# EAGLE design 2LD-20-mk-1.1.1 (EAGLE 7.5.0)
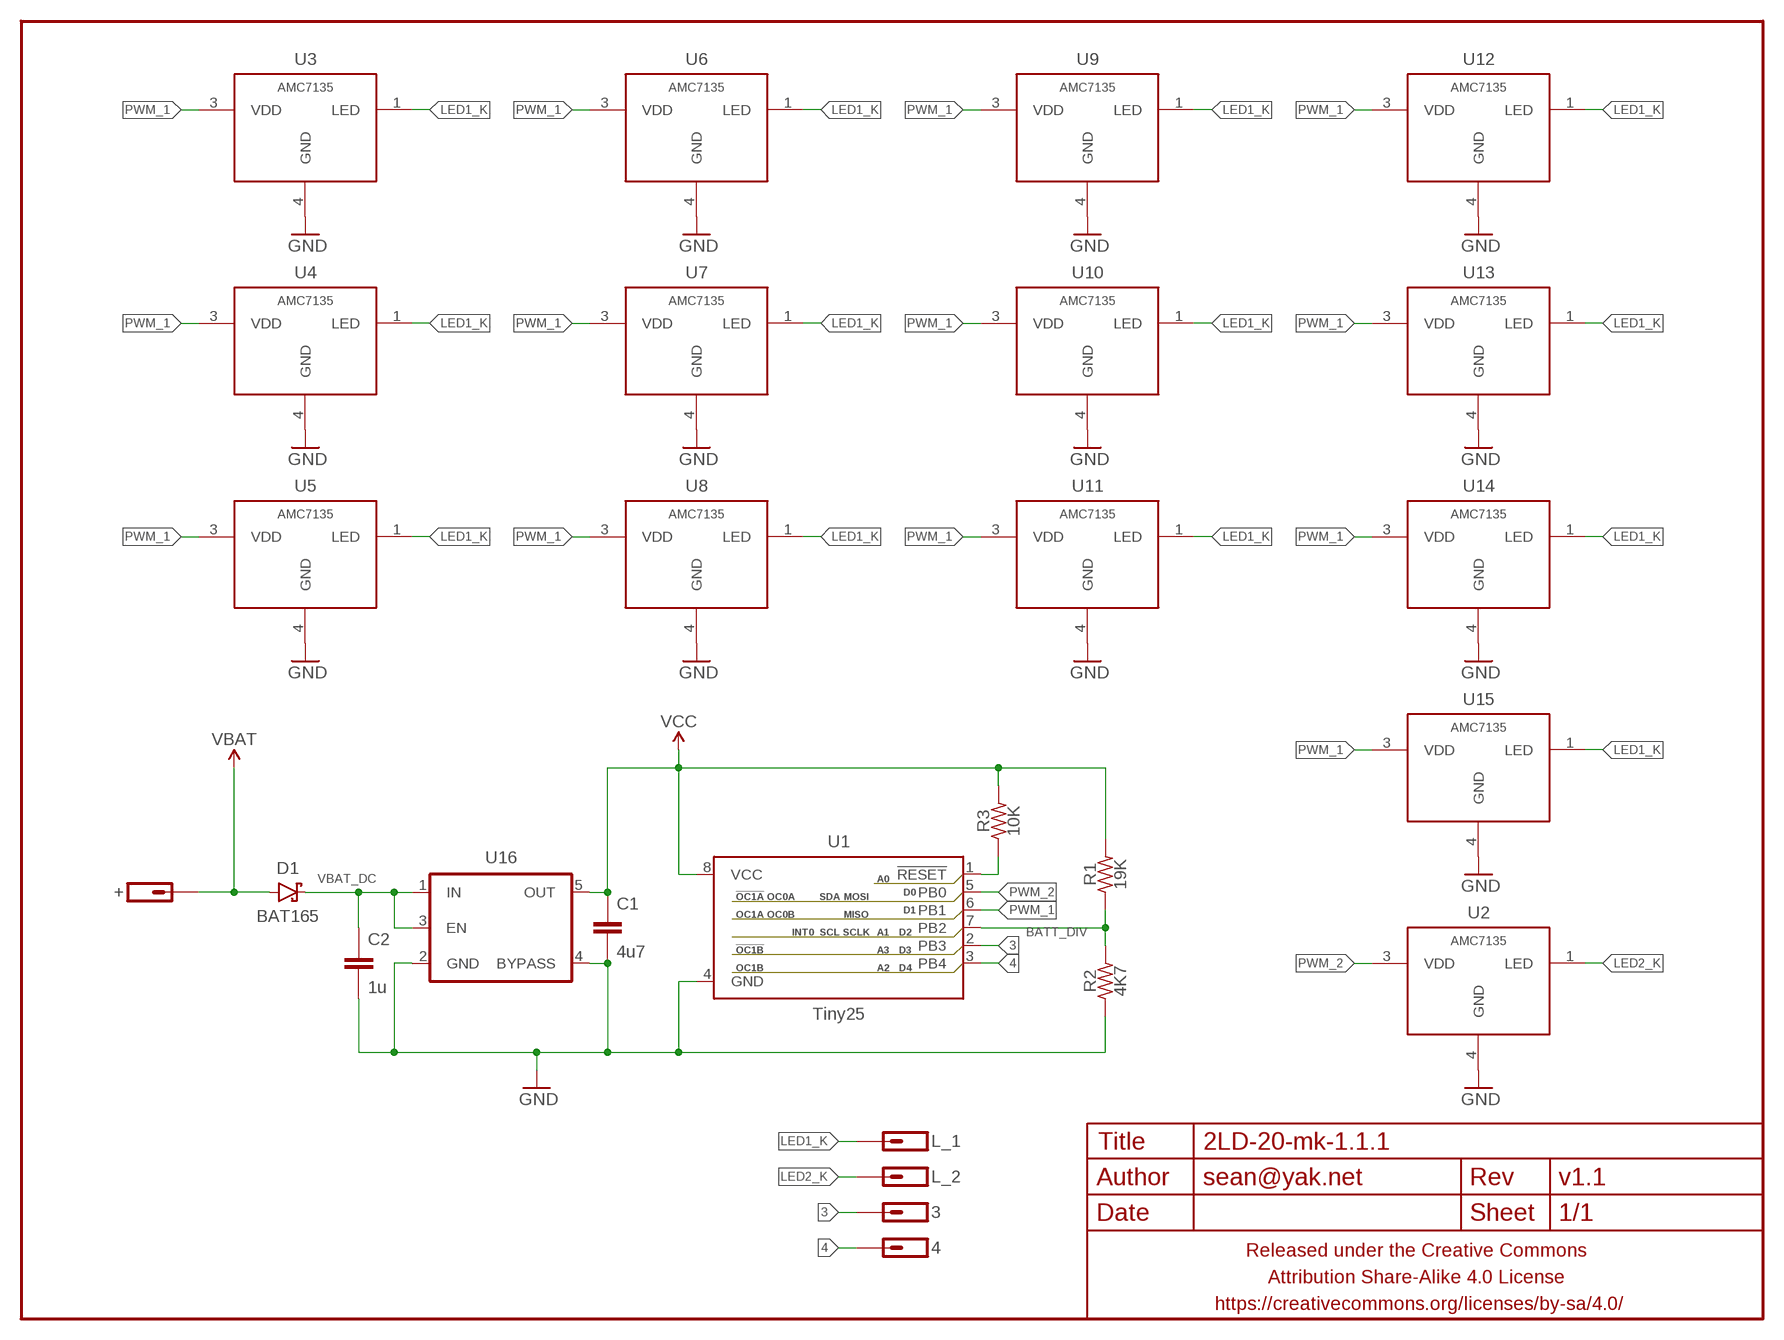
[diagram p0: schematic, sheet 1]

## Parts
3  M01SMD-0.8MM-DIA-NS  [1X01-SMD-0.8MM-DIA-NS]
4  M01SMD-0.8MM-DIA-NS  [1X01-SMD-0.8MM-DIA-NS]
+  M01PTH-1MM-CIR-NS  [1X01-1MM-CIR-NS]
C1  4u7  CAPACITOR-CERAMICC0603-TIGHTER  [C0603-TIGHTER]
C2  1u  CAPACITOR-CERAMICC0402  [C0402]
D1  BAT165  DIODE-SCHOTTKYSOD323  [SOD323-SCHOTTKY]
FRAME1  FRAME-LETTERNO_PACKAGE  [DUMMY]
L_1  M011X01-0.9MM-CIR  [1X01-0.9MM-CIR]
L_2  M01PTH-0.8MM-CIR  [1X01-0.8MM-CIR]
R1  19K  RESISTORR0402  [R0402]
R2  4K7  RESISTORR0402  [R0402]
R3  10K  RESISTORR0402  [R0402]
U1  Tiny25  ATTINY13SOIC-NARROWPADS  [SO08-NARROWER]
U2  AMC7135  AMC7135SOT-89-NOTHERM-ROUNDED-LESS  [SOT89-NOTHERM-ROUNDED-LESS]
U3  AMC7135  AMC7135SOT-89-NOTHERM-ROUNDED-LESS  [SOT89-NOTHERM-ROUNDED-LESS]
U4  AMC7135  AMC7135SOT-89-NOTHERM-ROUNDED-LESS  [SOT89-NOTHERM-ROUNDED-LESS]
U5  AMC7135  AMC7135SOT-89-NOTHERM-ROUNDED-LESS  [SOT89-NOTHERM-ROUNDED-LESS]
U6  AMC7135  AMC7135SOT-89-NOTHERM-ROUNDED-LESS  [SOT89-NOTHERM-ROUNDED-LESS]
U7  AMC7135  AMC7135SOT-89-NOTHERM-ROUNDED-LESS  [SOT89-NOTHERM-ROUNDED-LESS]
U8  AMC7135  AMC7135SOT-89-NOTHERM-ROUNDED-LESS  [SOT89-NOTHERM-ROUNDED-LESS]
U9  AMC7135  AMC7135SOT-89-NOTHERM-ROUNDED-LESS  [SOT89-NOTHERM-ROUNDED-LESS]
U10  AMC7135  AMC7135SOT-89-NOTHERM-ROUNDED-LESS  [SOT89-NOTHERM-ROUNDED-LESS]
U11  AMC7135  AMC7135SOT-89-NOTHERM-ROUNDED-LESS  [SOT89-NOTHERM-ROUNDED-LESS]
U12  AMC7135  AMC7135SOT-89-NOTHERM-ROUNDED-LESS  [SOT89-NOTHERM-ROUNDED-LESS]
U13  AMC7135  AMC7135SOT-89-NOTHERM-ROUNDED-LESS  [SOT89-NOTHERM-ROUNDED-LESS]
U14  AMC7135  AMC7135SOT-89-NOTHERM-ROUNDED-LESS  [SOT89-NOTHERM-ROUNDED-LESS]
U15  AMC7135  AMC7135SOT-89-NOTHERM-ROUNDED-LESS  [SOT89-NOTHERM-ROUNDED-LESS]
U16  V_REG_SOT-23-5AP2112  [SOT23-5]

## Nets
3: 3.P$1 U1.2(PB3)
4: 4.P$1 U1.3(PB4)
BATT_DIV: R1.1 R2.2 U1.7(PB2)
GND: C1.2 C2.2 R2.1 U1.4(GND) U2.4(GND) U3.4(GND) U4.4(GND) U5.4(GND) U6.4(GND) U7.4(GND) U8.4(GND) U9.4(GND) U10.4(GND) U11.4(GND) U12.4(GND) U13.4(GND) U14.4(GND) U15.4(GND) U16.2(GND) U16.4(BYPASS)
LED1_K: L_1.P$1 U3.1(LED) U4.1(LED) U5.1(LED) U6.1(LED) U7.1(LED) U8.1(LED) U9.1(LED) U10.1(LED) U11.1(LED) U12.1(LED) U13.1(LED) U14.1(LED) U15.1(LED)
LED2_K: L_2.1 U2.1(LED)
N$1: R3.1 U1.1(!RESET)
PWM_1: U1.6(PB1) U3.3(VDD) U4.3(VDD) U5.3(VDD) U6.3(VDD) U7.3(VDD) U8.3(VDD) U9.3(VDD) U10.3(VDD) U11.3(VDD) U12.3(VDD) U13.3(VDD) U14.3(VDD) U15.3(VDD)
PWM_2: U1.5(PB0) U2.3(VDD)
VBAT: +.1 D1.A
VBAT_DC: C2.1 D1.C U16.1(IN) U16.3(EN)
VCC: C1.1 R1.2 R3.2 U1.8(VCC) U16.5(OUT)

## Library data of the parts
3 4 + L_1 L_2 = a_parts:M01: Header 1 Standard 1-pin 0.1" header. Use with straight break away headers (SKU : PRT-00116), right angle break away headers (PRT-00553), swiss pins (PRT-00743), machine pins (PRT-00117), and female headers (PRT-00115).
C1 C2 = a_parts:CAPACITOR-CERAMIC: CAPACITOR, European symbol
D1 = a_parts:DIODE-SCHOTTKY: Schottky diodes in SFE's production catalog BAT20J 1A 23V 0.62Vf RB751 120mA 40V 0.37Vf PMEG4005EJ 0.5A 40V 0.42Vf MBRA140 1A 40V 0.5Vf B340A 3A 40V SMA
FRAME1 = a_parts:FRAME-LETTER: Schematic Frame Standard 8.5x11 US Letter frame; DESIGNER: sean@yak.net; VERSION: v1.1
R1-R3 = a_parts:RESISTOR: RESISTOR, American symbol
U1 = a_parts:ATTINY13: Atmel 8-pin 1kB flash uC
U2-U15 = a_parts:AMC7135
U16 = a_parts:V_REG_SOT-23-5

## Board
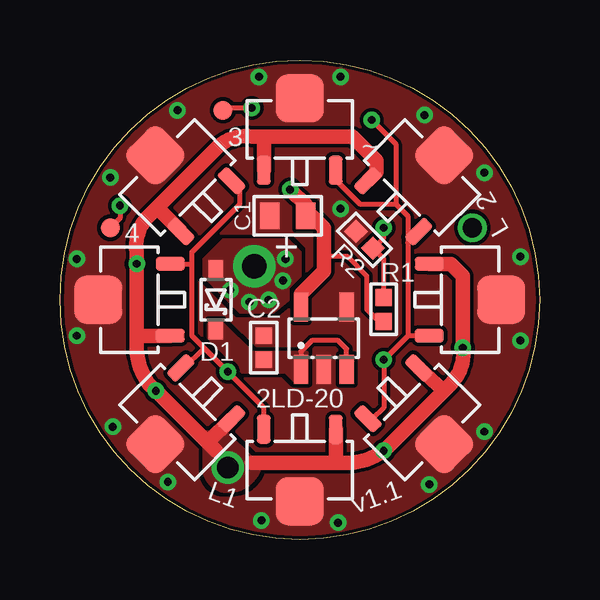
[diagram p1: board, top side]
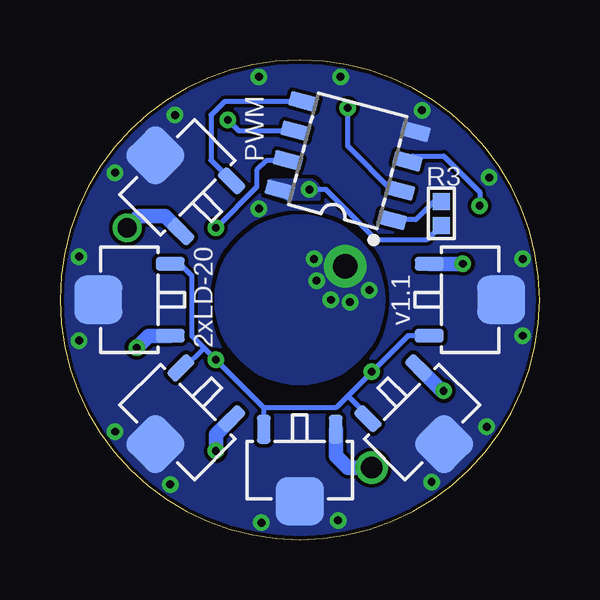
[diagram p2: board, bottom side, seen from below]

Size 20 x 20 mm. Coordinates in mm from the lower left corner, seen from the top.
Outline: 0,10 arc-180 20,10 arc-180 0,10
Copper layers (1*16): Top 0.0356mm / dielectric 1.5011mm / Bottom 0.0356mm
Design rules "LaenPCBOrder2": minimum track width 6mil, minimum drill 13mil, track to track 6mil, track to pad 6mil, pad to pad 6mil, via to via 6mil, smd to smd 6mil, copper to edge 6mil, drill to drill 6mil, minimum pad ring 7mil, minimum via ring 7mil, stop-mask expansion 3mil, vias tented up to drill 20mil, thermal gap 10mil

### Footprints (pad centres in the part's own frame; a part is rotated, then mirrored left to right if it is on the bottom)
1X01-SMD-0.8MM-DIA-NS = smd 0.8 x 0.8: P$1 0,0
1X01-1MM-CIR-NS = drill 1.016 pad 1.778: 1 0,0
C0603-TIGHTER = smd 0.8 x 1.1: 1 -0.75,0; 2 0.75,0
C0402 = smd 0.7 x 0.7: 1 -0.5,0; 2 0.5,0
SOD323-SCHOTTKY = smd 0.8 x 0.6: A -1.25,0; C 1.25,0
1X01-0.9MM-CIR = drill 0.9 pad 1.3: P$1 0,0
1X01-0.8MM-CIR = drill 0.8: 1 0,0
R0402 = smd 0.7 x 0.7: 1 -0.5,0; 2 0.5,0
SO08-NARROWER = smd 0.6 x 1.2: 1 -1.905,-2.416; 2 -0.635,-2.416; 3 0.635,-2.416; 4 1.905,-2.416; 5 1.905,2.416; 6 0.635,2.416; 7 -0.635,2.416; 8 -1.905,2.416
SOT89-NOTHERM-ROUNDED-LESS = smd 0.58 x 1.2: 1 -1.5,-1.7; 3 1.5,-1.7 | smd 2 x 2: 4 0,1.3
SOT23-5 = smd 0.6 x 1.2: 1 -0.95,-1.3; 2 0,-1.3; 3 0.95,-1.3; 4 0.95,1.3; 5 -0.95,1.3

### Placement (x,y rotation side)
3  6.8,17.9 0 top
4  2.1,13 0 top
+  8.1,11.4 90 top
C1  9.5,13.5 180 top
C2  8.5,8 90 top
D1  6.5,10 270 top
FRAME1  0,0 0 top
L_1  7,3 270 top
L_2  17.2,13 90 top
R1  13.5,9.6 270 top
R2  12.7,12.5 315 top
R3  4.1,13.6 270 bottom
U1  8,15.8 75 bottom
U2  15.1,15.1 45 bottom
U3  4.9,4.9 135 top
U4  10,2.9 180 top
U5  15.1,4.9 225 top
U6  17.1,10 270 top
U7  10,17.1 0 top
U8  15.1,15.1 315 top
U9  17.1,10 90 bottom
U10  15.1,4.9 135 bottom
U11  10,2.9 180 bottom
U12  4.9,4.9 225 bottom
U13  2.9,10 270 bottom
U14  4.9,15.1 45 top
U15  2.9,10 90 top
U16  11,8.4 0 top

### Tracks (layer width: path | path; a pad name or v marks a point on that pad's centre or on a via)
3  (via drill 0.33)
  Top 0.2: v8,18 6.9,18 3.P$1
  Bottom 0.2: U1.2 5.89,14.5 6.1,14.5 8,16.4 v8,18
4  (via drill 0.33)
  Top 0.2: v2.5,13.92 2.5,13.4 4.P$1
  Bottom 0.2: U1.3 5.29,16 4,16 2.5,14.5 v2.5,13.92
BATT_DIV  (via drill 0.33)
  Top 0.2: v13.5,13 13.5,12.59 R2.2 13.5,11.7 R1.1
  Bottom 0.2: U1.7 11.39,15.81 11.8,15.4 11.8,14.7 v13.5,13
GND  (via drill 0.33)
  other vias: 8.3,19.3 11.7,19.3 4.9,17.9 17.7,15.3 15.2,17.7 19.2,11.8 19.2,8.3 17.7,4.5 15.4,2.3 11.6,0.7 8.4,0.8 4.5,2.4 2.2,4.7 0.7,8.5 0.7,11.7 2.1,15.1 11.7,13.8
  pour Top (isolate 0.152, rank 6, no thermals): 0,10 arc90 10,0 arc90 20,10 arc90 10,20 arc90
  pour Bottom (isolate 0.152, rank 6, no thermals): 20,10 arc-90 10,0 arc-90 0,10 arc-90 10,20 arc-90
LED1_K  (via drill 0.33)
  Top 0.6: 3.2,8.5 3.2,8 arc37 3.7,6.5 v4,6.2 6.15,4.05 | 3.2,8.5 v3.2,11.5 3.2,12 arc-53 3.7,13.5 4.05,13.85 | 11.6,3.2 12,3.2 arc37 v13.5,3.7 16,6.2 | 11.6,3.2 8,3.2 | 6.15,4.05 6.5,3.7 | 16,6.2 16.3,6.5 arc53 v16.8,8 16.8,11 16.3,11.5 U6.1 | 4.05,13.85 6.5,16.3 arc-53 8,16.8 8.5,16.8 | 8.5,16.8 12.2,16.8 13.2,15.8 13.2,15.32 U8.1 | U4.1 11.5,3.3 11.6,3.2 | U3.1 6.15,4.05 | U15.1 3.2,8.5 | U5.1 16,6.2 | U14.1 5.04,12.86 4.05,13.85 | U7.1 8.5,16.8
  Bottom 0.6: U13.1 v3.2,11.5 | U12.1 4.08,6.2 v4,6.2 | U10.1 13.5,4.38 v13.5,3.7 | U9.1 16.3,8.5 v16.8,8 | U11.1 8.5,3.5 8,3 L_1.P$1
  pour Top (isolate 0.152, rank 2, no thermals): 6.9,4.5 8,3.4 8.4,3.4 arc-90 7,2 arc-90 6,3 6,4.5
LED2_K
  Bottom 0.6: U2.1 15.62,13.5 16.7,13.5 L_2.1
N$1
  Bottom 0.2: R3.1 4.4,14.1 5.17,13.34 U1.1
PWM_1  (via drill 0.33)
  Top 0.2: U8.3 14.5,12.38 | 14.5,12.38 14.5,8.5 | v13,17.5 14,16.5 14,14 | 14,14 12.5,14 11.5,15 U7.3 | 14,14 14.5,13.5 14.5,12.38 | 14.5,8.5 v13.5,7.5 13.5,5.5 13.04,5.04 U5.3 | U4.3 8.5,5.5 v7,7 6,8 | U6.3 14.5,8.5 | 6,8 5.5,8.5 5.5,11.5 | 5.5,11.5 5.5,12 7.5,14 7.5,14.62 U14.3 | U3.3 5.16,7.16 6,8 | U15.3 5.5,11.5
  Bottom 0.2: U1.6 12.54,17.04 v13,17.5 | U13.3 5.5,8.5 v7,7 8,6 | 8,6 8.5,5.5 11.5,5.5 | U12.3 7.16,5.16 8,6 | U11.3 11.5,5.5 | 11.5,5.5 v13.5,7.5 14,8 | 14,8 14.5,8.5 14.5,11 15,11.5 U9.3 | U10.3 14.84,7.16 14,8
PWM_2
  Bottom 0.2: U1.5 13.13,18.27 13.7,17.7 13.7,15.82 U2.3
VBAT  (via drill 0.33)
  other vias: 7.1,10.4 7.9,9.9 8.7,10 9.3,10.8 9.4,11.7
  pour Bottom (isolate 0.152, no thermals): 6.5,10 arc-180 13.5,10 arc-180
  pour Top (isolate 0.152, rank 2, no thermals): 6,11.7 6,11 7.5,9.5 8.9,9.5 9.5,10 9.5,10.5 10,11 10,12 9.5,12.5 6.8,12.5
VBAT_DC
  Top 0.2: U16.3 11.95,7.95 11.6,8.3 10.5,8.3 10.05,7.85 U16.1
  pour Top (isolate 0.152, rank 2, no thermals): 6.2,9 6.8,9 8,7.8 10.3,7.8 10.3,6.6 9.8,6.6 9.4,7 7.6,7 6.2,8.4
VCC  (via drill 0.33)
  Top 0.2: R1.2 13.3,9.1 12.8,9.6 12.8,11 12,11.8 11,11.8 11,11.2
  Top 0.6: U16.5 10.05,10.25 11,11.2 11,13 10.5,13.5 C1.1 10.25,13.95 v9.6,14.6
  Bottom 0.2: 10.42,14.18 U1.8 | R3.2 4.7,12.5 6.8,12.5 8.9,14.6 v9.6,14.6
  pour Bottom (isolate 0.152, rank 2, no thermals): 9.2,14.5 arc-90 9.6,15 11.2,15 11.4,14.5 10.5,14.2 9.2,14.2

### Text on the board
tPlace: ~ | 2LD-20
bPlace: PWM | 2xLD-20
tNames: 2 | L | L1